# EAGLE design Relay Module v1.0 (EAGLE 7.2.0)
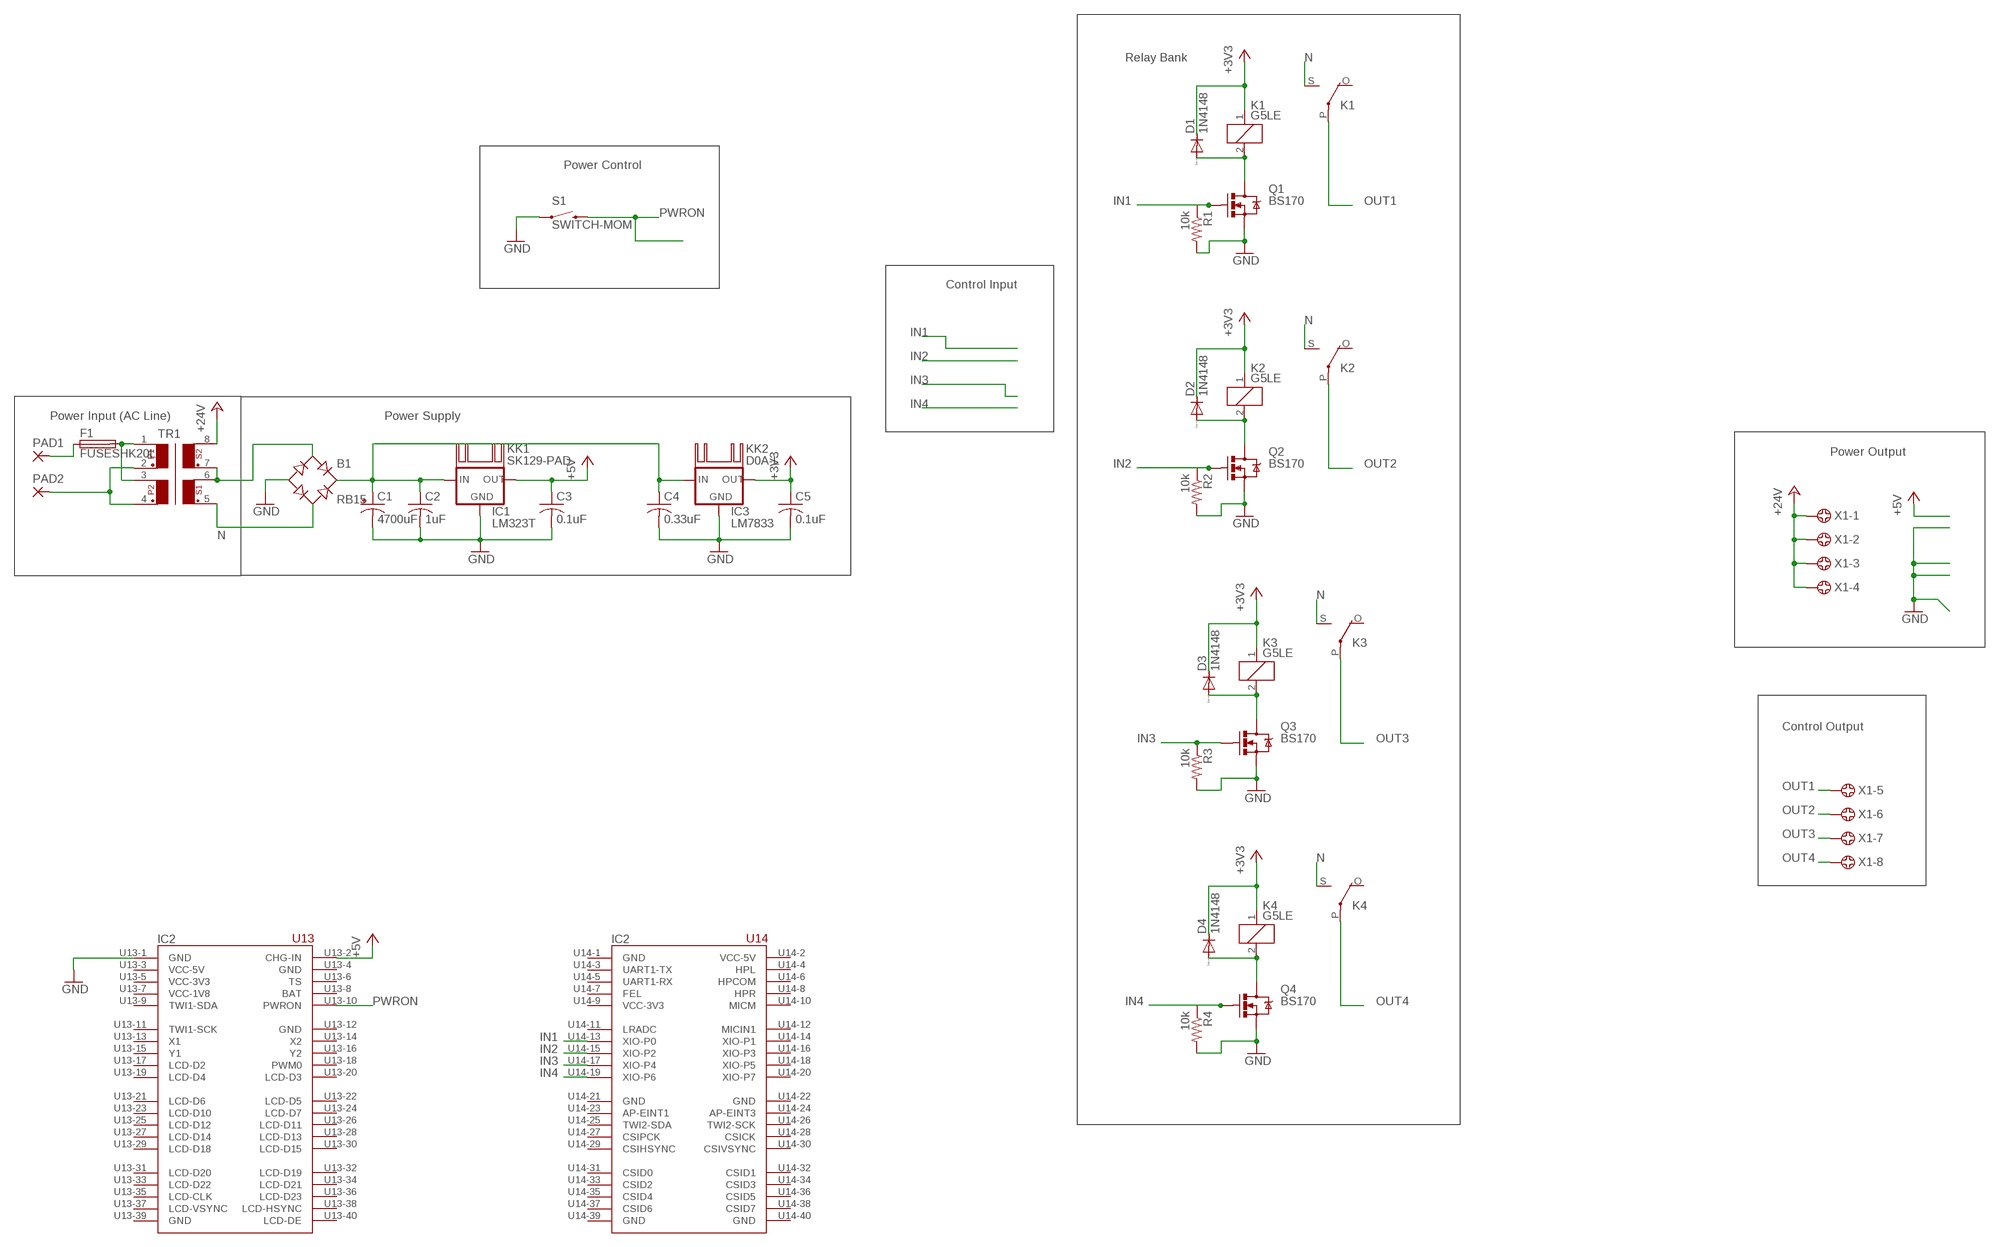
[diagram p0: schematic, sheet 1]

## Parts
B1  RB15  RECTIFIER-RB15  [RB15]
C1  4700uF  CPOL-USE7.5-18  [E7,5-18]
C2  1uF  C-US025-025X050  [C025-025X050]
C3  0.1uF  C-US025-025X050  [C025-025X050]
C4  0.33uF  C-US025-025X050  [C025-025X050]
C5  0.1uF  C-US025-025X050  [C025-025X050]
D1  1N4148  1N4148DO35-7  [DO35-7]
D2  1N4148  1N4148DO35-7  [DO35-7]
D3  1N4148  1N4148DO35-7  [DO35-7]
D4  1N4148  1N4148DO35-7  [DO35-7]
F1  FUSESHK20L  [SHK20L]
IC1  LM323T  LM323-TO3  [TO220S]
IC2  C_H_I_P-1_0  [C_H_I_P-1_0]
IC3  LM7833  78XXL  [78XXL]
K1  G5LE  [G5LE]
K2  G5LE  [G5LE]
K3  G5LE  [G5LE]
K4  G5LE  [G5LE]
KK1  SK129-PAD  [SK129]
KK2  D0A-L  [D02A-L]
PAD1  2,54/1,0  [2,54/1,0]
PAD2  2,54/1,0  [2,54/1,0]
Q1  BS170  MOSFET-NCHANNELBS170  [TO-92]
Q2  BS170  MOSFET-NCHANNELBS170  [TO-92]
Q3  BS170  MOSFET-NCHANNELBS170  [TO-92]
Q4  BS170  MOSFET-NCHANNELBS170  [TO-92]
R1  10k  R-US_0207/10  [0207/10]
R2  10k  R-US_0207/10  [0207/10]
R3  10k  R-US_0207/10  [0207/10]
R4  10k  R-US_0207/10  [0207/10]
S1  SWITCH-MOM  SWITCH-MOMENTARY-2PTH  [TACTILE-PTH]
TR1  FS24-1500-C2  [FS24-1500-C2]
X1  5202-08-N-02  [5202-08-N-02]

## Nets
+3V3 [power]: C5.1 D1.C D2.C D3.C D4.C IC3.OUT K1.1 K2.1 K3.1 K4.1
+5V [power]: C3.1 IC1.3(OUT) IC2.U13-2(CHG-IN)
+24V [power]: TR1.8 X1.1 X1.2 X1.3 X1.4
GND [power]: B1.- C1.- C2.2 C3.2 C4.2 C5.2 IC1.2(GND) IC2.U13-1(GND) IC3.GND Q1.3(S) Q2.3(S) Q3.3(S) Q4.3(S) R1.2 R2.2 R3.2 R4.2 S1.1
IN1: IC2.U14-13(XIO-P0) Q1.2(G) R1.1
IN2: IC2.U14-15(XIO-P2) Q2.2(G) R2.1
IN3: IC2.U14-17(XIO-P4) Q3.2(G) R3.1
IN4: IC2.U14-19(XIO-P6) Q4.2(G) R4.1
N [power]: B1.AC2 K1.S(2:S) K2.S(2:S) K3.S(2:S) K4.S(2:S) TR1.5
N$1 [power]: B1.+ C1.+ C2.1 C4.1 IC1.1(IN) IC3.IN
N$2 [power]: D1.A K1.2 Q1.1(D)
N$3: F1.2A TR1.1 TR1.3
N$4 [power]: D2.A K2.2 Q2.1(D)
N$6 [power]: D3.A K3.2 Q3.1(D)
N$7: F1.1A PAD1.1(P)
N$8 [power]: D4.A K4.2 Q4.1(D)
N$9 [power]: B1.AC1 TR1.6 TR1.7
N$10: PAD2.1(P) TR1.2 TR1.4
OUT1 [power]: K1.P(2:P) X1.5
OUT2 [power]: K2.P(2:P) X1.6
OUT3 [power]: K3.P(2:P) X1.7
OUT4 [power]: K4.P(2:P) X1.8
PWRON: IC2.U13-10(PWRON) S1.3
Unconnected: IC2.U13-3(VCC-5V) IC2.U13-5(VCC-3V3) IC2.U13-6(TS) IC2.U13-7(VCC-1V8) IC2.U13-9(TWI1-SDA) IC2.U13-11(TWI1-SCK) IC2.U13-13(X1) IC2.U13-14(X2) IC2.U13-15(Y1) IC2.U13-16(Y2) IC2.U13-17(LCD-D2) IC2.U13-18(PWM0) IC2.U13-19(LCD-D4) IC2.U13-20(LCD-D3) IC2.U13-21(LCD-D6) IC2.U13-22(LCD-D5) IC2.U13-23(LCD-D10) IC2.U13-24(LCD-D7) IC2.U13-25(LCD-D12) IC2.U13-26(LCD-D11) IC2.U13-27(LCD-D14) IC2.U13-28(LCD-D13) IC2.U13-29(LCD-D18) IC2.U13-30(LCD-D15) IC2.U13-31(LCD-D20) IC2.U13-32(LCD-D19) IC2.U13-33(LCD-D22) IC2.U13-34(LCD-D21) IC2.U13-35(LCD-CLK) IC2.U13-36(LCD-D23) IC2.U13-37(LCD-VSYNC) IC2.U13-38(LCD-HSYNC) IC2.U13-40(LCD-DE) IC2.U14-2(VCC-5V) IC2.U14-3(UART1-TX) IC2.U14-4(HPL) IC2.U14-5(UART1-RX) IC2.U14-6(HPCOM) IC2.U14-7(FEL) IC2.U14-8(HPR) IC2.U14-9(VCC-3V3) IC2.U14-10(MICM) IC2.U14-11(LRADC) IC2.U14-12(MICIN1) IC2.U14-14(XIO-P1) IC2.U14-16(XIO-P3) IC2.U14-18(XIO-P5) IC2.U14-20(XIO-P7) IC2.U14-23(AP-EINT1) IC2.U14-24(AP-EINT3) IC2.U14-25(TWI2-SDA) IC2.U14-26(TWI2-SCK) IC2.U14-27(CSIPCK) IC2.U14-28(CSICK) IC2.U14-29(CSIHSYNC) IC2.U14-30(CSIVSYNC) IC2.U14-31(CSID0) IC2.U14-32(CSID1) IC2.U14-33(CSID2) IC2.U14-34(CSID3) IC2.U14-35(CSID4) IC2.U14-36(CSID5) IC2.U14-37(CSID6) IC2.U14-38(CSID7) K1.O(2:O) K2.O(2:O) K3.O(2:O) K4.O(2:O) KK1.A2,5(K) KK1.B2,5(K)

## Notes on the sheet
- Relay Bank
- Power Control
- Control Input
- Power Input (AC Line) | Power Supply
- Power Output
- Control Output

## Power pins joined to a net without a drawn wire
BAT: IC2.U13-8(BAT)
GND: IC2.U13-4(GND) IC2.U13-12(GND) IC2.U13-39(GND) IC2.U14-1(GND) IC2.U14-21(GND) IC2.U14-22(GND) IC2.U14-39(GND) IC2.U14-40(GND)

## Library data of the parts
B1 = rectifier:RECTIFIER-: Rectifier
C1 = rcl:CPOL-US: POLARIZED CAPACITOR, American symbol
C2-C5 = rcl:C-US: CAPACITOR, American symbol
D1-D4 = diode:1N4148: DIODE high speed (Philips)
F1 = fuse:FUSE: Fuse; OC_FARNELL: unknown; OC_NEWARK: unknown
IC1 = v-reg:LM323-TO3: VOLTAGE REGULATOR
IC2 = SENG:C_H_I_P-1_0: C.H.I.P. 1.0 Linux computer module with on chip power management unit
IC3 = v-reg:78XXL: VOLTAGE REGULATOR
K1-K4 = relay:G5LE: RELAY 1 x switch, 10 A/120 V AC, 8 A/30 V DC, Omron; OC_FARNELL: unknown; OC_NEWARK: unknown
KK1 = heatsink:SK129-PAD: HEATSINK manufacturer Fischer/distributor Buerklin
KK2 = heatsink:D0A-L: HEATSINK distributor Schukat
PAD1 PAD2 = wirepad:2,54/1,0: THROUGH-HOLE PAD
Q1-Q4 = SparkFun-DiscreteSemi:MOSFET-NCHANNEL: Common NMOSFET Parts MFG P/N Store ID Prod ID FDD8780 TRANS-09984 SI7820DN TRANS-11055 FDS6630A IC-08089 2N7002PW TRANS-11151 FQP30N06L COM-10213 TRANS-10060 BSS123LT1G TRANS-08345 BSS138 TRANS-00830 BS170 2N7000
R1-R4 = rcl:R-US_: RESISTOR, American symbol
S1 = SparkFun-Electromechanical:SWITCH-MOMENTARY-2: Various NO switches- pushbuttons, reed, etc; PROD_ID: SWCH-08441
TR1 = trafo:FS24-1500-C2: TRANSFORMER 2 primary winding, 2 secondary windings, mounting holes ERA
X1 = con-ebyelectro:5202-08-N-02

## Net classes
0 default: width 0.508 mm, clearance 0.254 mm
1 power: width 1.27 mm, clearance 0.254 mm

## Board
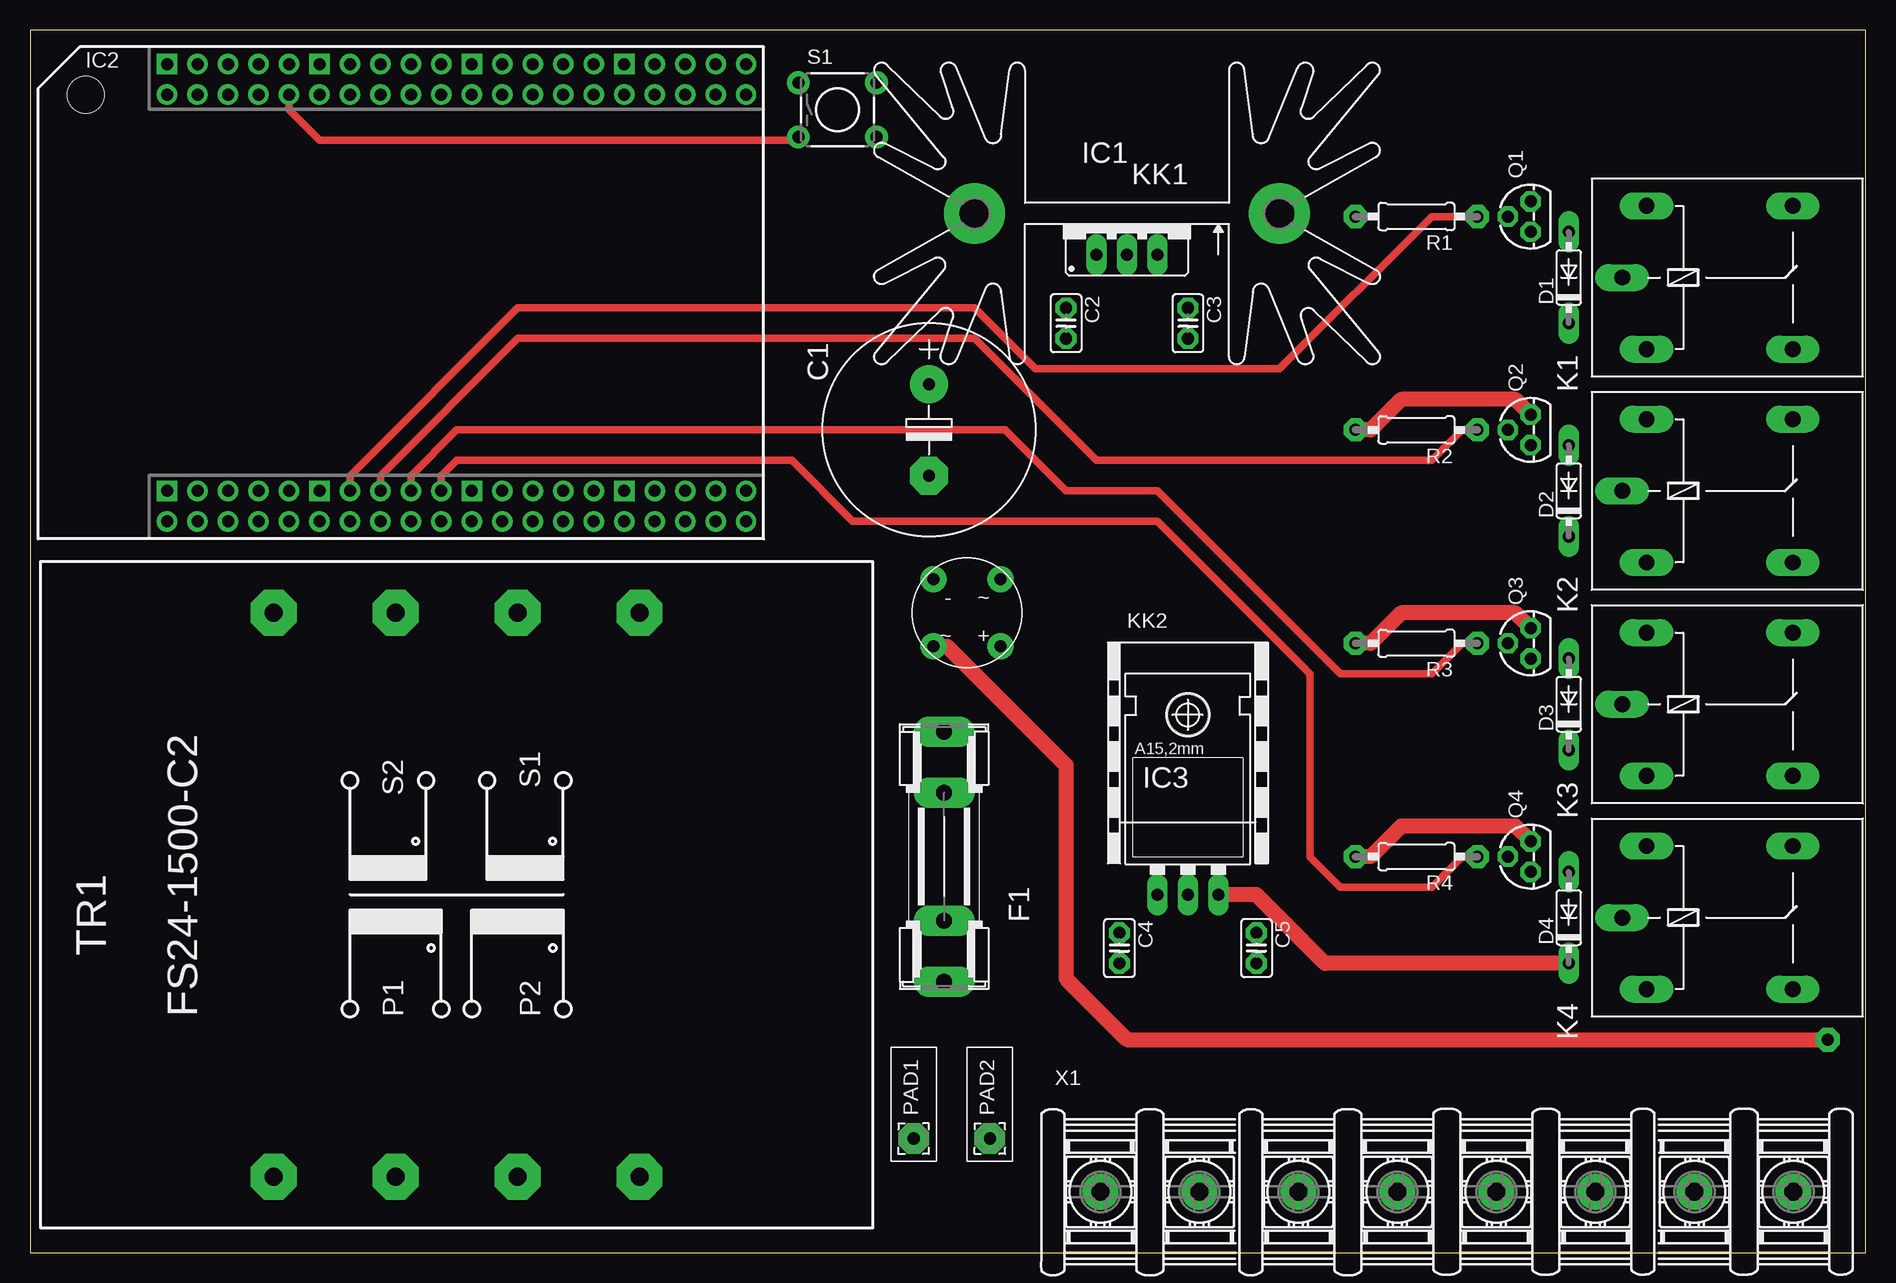
[diagram p1: board, top side]
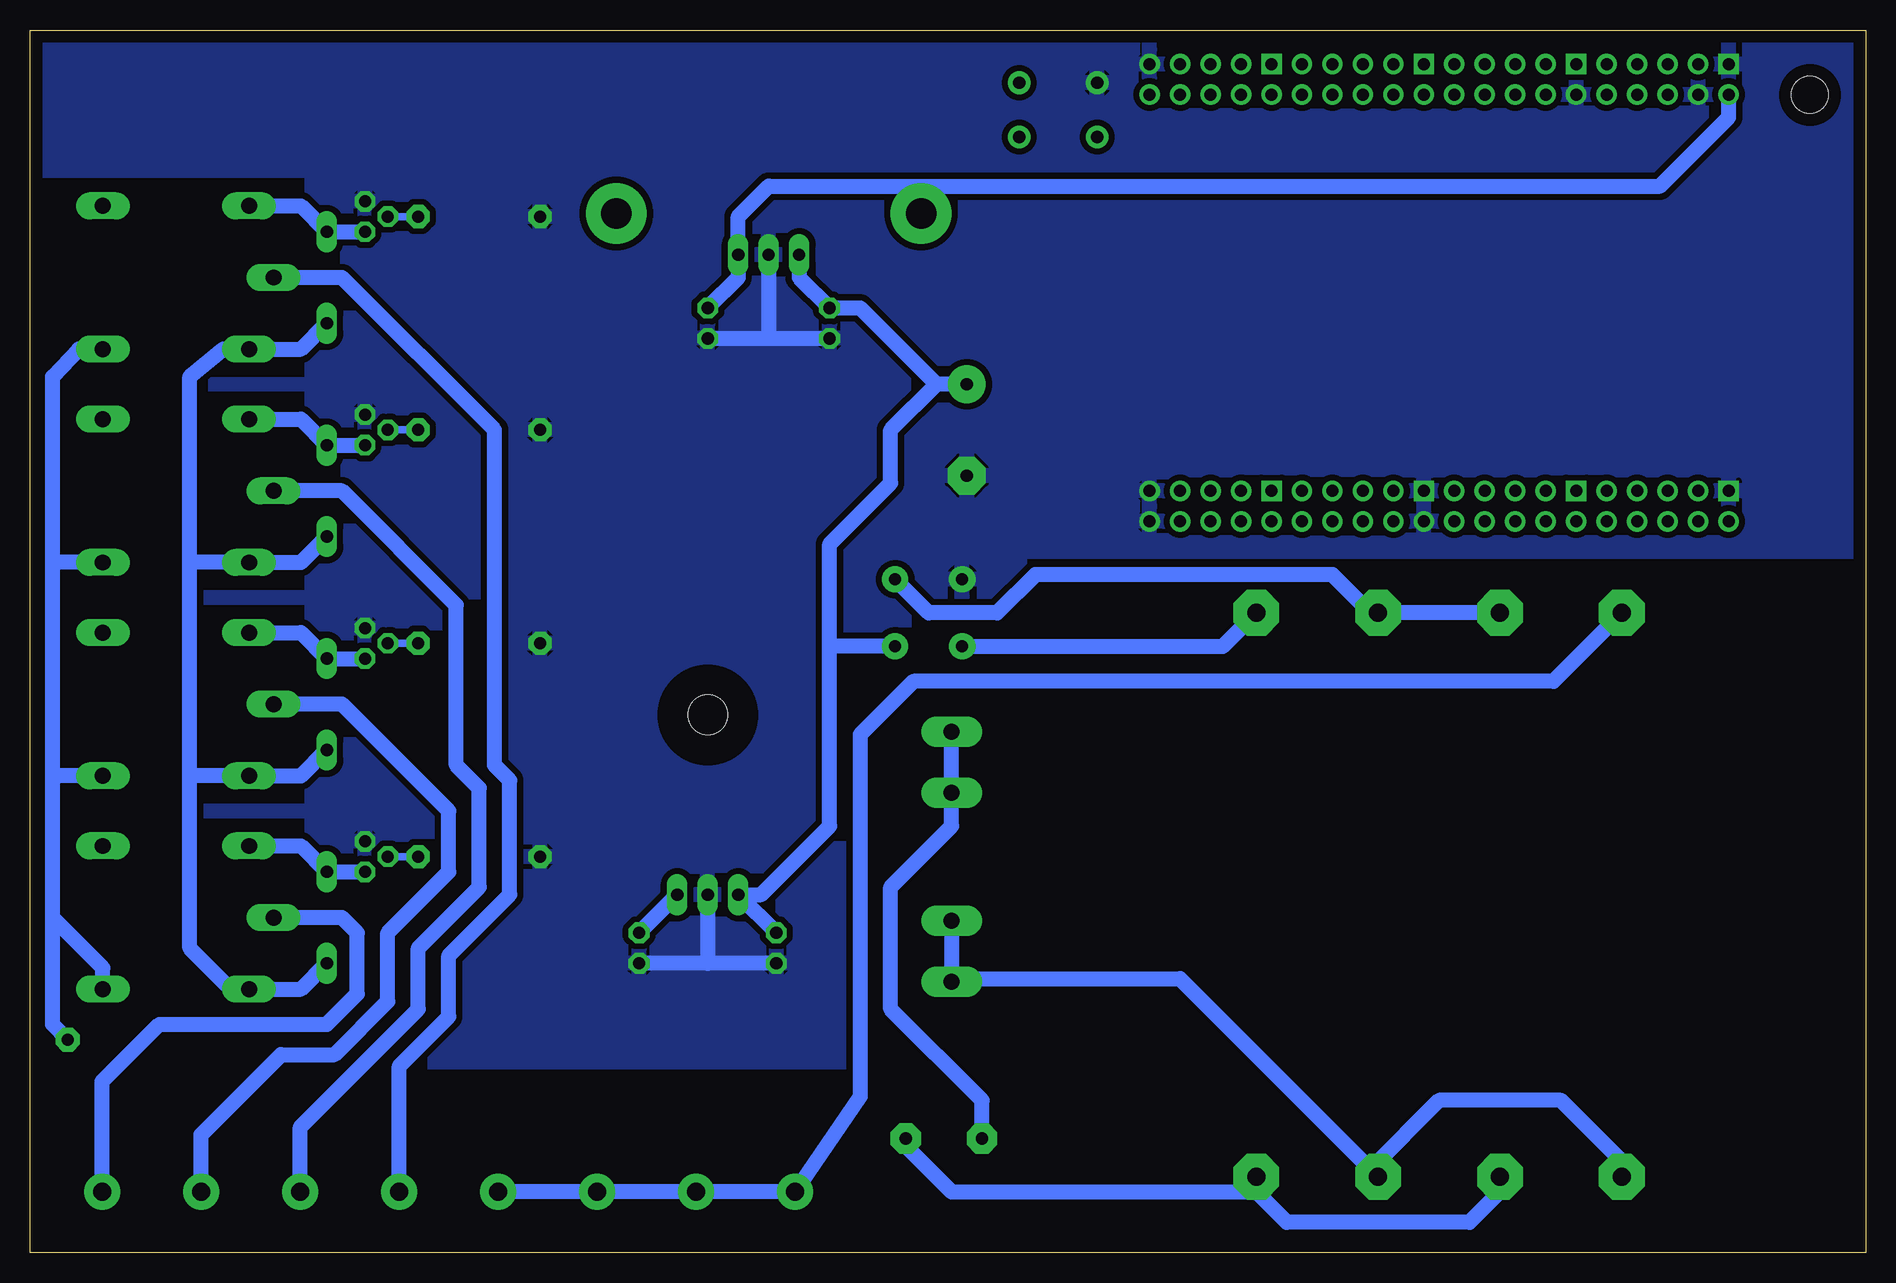
[diagram p2: board, bottom side, seen from below]

Size 153.01 x 101.91 mm. Coordinates in mm from the lower left corner, seen from the top.
Outline: 0,0 153.01,0 153.01,101.91 0,101.91 0,0
Copper layers (1*16): Top 0.035mm / dielectric 1.5mm / Bottom 0.035mm
Design rules "HomeFab": minimum track width 24mil, minimum drill 39mil, track to track 20mil, track to pad 20mil, pad to pad 20mil, via to via 20mil, smd to smd 8mil, copper to edge 40mil, drill to drill 8mil, minimum pad ring 10mil, minimum via ring 8mil, stop-mask expansion 4mil, vias tented up to drill 0mil, thermal gap 10mil
bRestrict: area 83.8,0 to 152.4,15.2

### Footprints (pad centres in the part's own frame; a part is rotated, then mirrored left to right if it is on the bottom)
RB15 = drill 1 pad 2.184: + -2.794,2.794; - 2.794,-2.794; AC1 -2.794,-2.794; AC2 2.794,2.794
E7,5-18 = drill 1.016 pad 3.15: + -3.81,0 | drill 1.016 pad 3.15 octagon: - 3.81,0
C025-025X050 = drill 1.016 pad 1.676 octagon: 1 -1.27,0; 2 1.27,0
DO35-7 = drill 1.016 long: A 3.81,0; C -3.81,0
SHK20L = drill 1.321 pad 2.54 long: 1A -10.414,0; 1B -5.334,0; 2A 10.414,0; 2B 5.334,0
TO220S = drill 1.016 long: 1 -2.54,-2.54; 2 0,-2.54; 3 2.54,-2.54
C_H_I_P-1_0 = drill 1 square: U13-1 0,0; U13-11 -12.7,0; U13-21 -25.4,0; U13-31 -38.1,0; U14-1 0,35.56; U14-11 -12.7,35.56; U14-21 -25.4,35.56; U14-31 -38.1,35.56 | drill 1: U13-2 0,2.54; U13-3 -2.54,0; U13-4 -2.54,2.54; U13-5 -5.08,0; U13-6 -5.08,2.54; U13-7 -7.62,0; U13-8 -7.62,2.54; U13-9 -10.16,0; U13-10 -10.16,2.54; U13-12 -12.7,2.54; U13-13 -15.24,0; U13-14 -15.24,2.54; U13-15 -17.78,0; U13-16 -17.78,2.54; U13-17 -20.32,0; U13-18 -20.32,2.54; U13-19 -22.86,0; U13-20 -22.86,2.54; U13-22 -25.4,2.54; U13-23 -27.94,0; U13-24 -27.94,2.54; U13-25 -30.48,0; U13-26 -30.48,2.54; U13-27 -33.02,0; U13-28 -33.02,2.54; U13-29 -35.56,0; U13-30 -35.56,2.54; U13-32 -38.1,2.54; U13-33 -40.64,0; U13-34 -40.64,2.54; U13-35 -43.18,0; U13-36 -43.18,2.54; U13-37 -45.72,0; U13-38 -45.72,2.54; U13-39 -48.26,0; U13-40 -48.26,2.54; U14-2 0,38.1; U14-3 -2.54,35.56; U14-4 -2.54,38.1; U14-5 -5.08,35.56; U14-6 -5.08,38.1; U14-7 -7.62,35.56; U14-8 -7.62,38.1; U14-9 -10.16,35.56; U14-10 -10.16,38.1; U14-12 -12.7,38.1; U14-13 -15.24,35.56; U14-14 -15.24,38.1; U14-15 -17.78,35.56; U14-16 -17.78,38.1; U14-17 -20.32,35.56; U14-18 -20.32,38.1; U14-19 -22.86,35.56; U14-20 -22.86,38.1; U14-22 -25.4,38.1; U14-23 -27.94,35.56; U14-24 -27.94,38.1; U14-25 -30.48,35.56; U14-26 -30.48,38.1; U14-27 -33.02,35.56; U14-28 -33.02,38.1; U14-29 -35.56,35.56; U14-30 -35.56,38.1; U14-32 -38.1,38.1; U14-33 -40.64,35.56; U14-34 -40.64,38.1; U14-35 -43.18,35.56; U14-36 -43.18,38.1; U14-37 -45.72,35.56; U14-38 -45.72,38.1; U14-39 -48.26,35.56; U14-40 -48.26,38.1 | hole 3.08: 6.78,2.56
78XXL = drill 1.016 long: GND 0,-3.81; IN -2.54,-3.81; OUT 2.54,-3.81 | hole 3.302: 0,11.176
G5LE = drill 1.321 long: 1 -7.493,-5.969; 2 -7.493,5.969; O 4.699,5.969; P -9.525,0; S 4.699,-5.969
SK129 = drill 2.54 pad 5.08: A2,5 -12.7,-0.889; B2,5 12.7,-0.889
2,54/1,0 = drill 1.016 pad 2.54 octagon: 1 0,0
TO-92 = drill 1 pad 1.676 octagon: 1 -1.27,0; 2 0,1.905; 3 1.27,0
0207/10 = drill 1 pad 1.93 octagon: 1 -5.08,0; 2 5.08,0
TACTILE-PTH = drill 1.016 pad 1.88: 1 -3.251,2.261; 2 3.251,2.261; 3 -3.251,-2.261; 4 3.251,-2.261
FS24-1500-C2 = drill 1.5 pad 3.81 octagon: 1 -23.495,15.24; 2 -23.495,5.08; 3 -23.495,-5.08; 4 -23.495,-15.24; 5 23.495,-15.24; 6 23.495,-5.08; 7 23.495,5.08; 8 23.495,15.24
5202-08-N-02 = drill 1.5 pad 3: 1 -28.885,0; 2 -20.635,0; 3 -12.375,0; 4 -4.125,0; 5 4.125,0; 6 12.375,0; 7 20.635,0; 8 28.885,0

### Placement (x,y rotation side)
B1  78.11,53.34 180 top
C1  74.93,68.58 270 top
C2  86.36,77.47 270 top
C3  96.52,77.47 270 top
C4  90.81,25.4 270 top
C5  102.23,25.4 270 top
D1  128.27,81.28 90 top
D2  128.27,63.5 90 top
D3  128.27,45.72 90 top
D4  128.27,27.94 90 top
F1  76.2,33.02 270 top
IC1  91.44,85.72 0 top
IC2  11.43,99.06 180 top
IC3  96.52,33.66 0 top
K1  142.24,81.28 0 top
K2  142.24,63.5 0 top
K3  142.24,45.72 0 top
K4  142.24,27.94 0 top
KK1  91.44,85.72 180 top
KK2  96.52,39.37 270 top
PAD1  73.66,9.53 90 top
PAD2  80.01,9.53 90 top
Q1  125.09,86.36 90 top
Q2  125.09,68.58 90 top
Q3  125.09,50.8 90 top
Q4  125.09,33.02 90 top
R1  115.57,86.36 180 top
R2  115.57,68.58 180 top
R3  115.57,50.8 180 top
R4  115.57,33.02 180 top
S1  67.31,95.25 0 top
TR1  35.56,29.84 90 top
X1  118.11,5.08 0 top

### Tracks (layer width: path | path; a pad name or v marks a point on that pad's centre or on a via)
+3V3
  Top 1.27: D4.C 107.95,24.13 102.23,29.84 IC3.OUT
  Bottom 1.27: 139.7,40.01 139.7,25.4 136.27,21.97 K4.1 130.43,21.97 D4.C | 139.7,40.01 139.7,57.78 | 139.7,57.78 139.7,73.03 136.91,75.31 K1.1 130.43,75.31 D1.C | 139.7,57.78 139.45,57.53 K2.1 130.43,57.53 D2.C | 139.7,40.01 139.45,39.75 K3.1 130.43,39.75 D3.C | IC3.OUT C5.1
+5V
  Bottom 1.27: C3.1 93.98,81.28 IC1.3 93.98,86.36 91.44,88.9 17.14,88.9 11.43,94.61 IC2.U13-2
+24V
  Bottom 1.27: TR1.8 26.04,47.62 79.38,47.62 83.82,43.18 83.82,13.03 X1.1 X1.2 X1.3 X1.4
GND
  Top 1.27: Q2.3 123.83,71.12 114.3,71.12 111.76,68.58 R2.2 | Q3.3 123.83,53.34 114.3,53.34 111.76,50.8 R3.2 | Q4.3 123.83,35.56 114.3,35.56 111.76,33.02 R4.2
  Bottom 1.27: C4.2 96.52,24.13 | 96.52,24.13 C5.2 | IC3.GND 96.52,24.13 | C3.2 91.44,76.2 | 91.44,76.2 C2.2 | IC1.2 91.44,76.2
  pour Bottom: 0,0 152.4,0 152.4,101.6 0,101.6
IN1
  Top 0.61: R1.1 116.84,86.36 104.14,73.66 83.82,73.66 78.74,78.74 40.64,78.74 26.67,64.77 IC2.U14-13
  Bottom 0.61: Q1.2 R1.1
IN2
  Top 0.61: R2.1 119.38,68.58 116.84,66.04 88.9,66.04 78.74,76.2 40.64,76.2 29.21,64.77 IC2.U14-15
  Bottom 0.61: Q2.2 R2.1
IN3
  Top 0.61: R3.1 119.38,50.8 116.84,48.26 109.22,48.26 93.98,63.5 86.36,63.5 81.28,68.58 35.56,68.58 31.75,64.77 IC2.U14-17
  Bottom 0.61: Q3.2 R3.1
IN4
  Top 0.61: R4.1 119.38,33.02 116.84,30.48 109.22,30.48 106.68,33.02 106.68,48.26 93.98,60.96 68.58,60.96 63.5,66.04 35.56,66.04 34.29,64.77 IC2.U14-19
  Bottom 0.61: Q4.2 R4.1
N  (via drill 1 pad 1.68)
  Top 1.27: B1.AC2 76.45,50.55 86.36,40.64 86.36,22.86 91.44,17.78 v149.86,17.78
  Bottom 1.27: K4.S 146.94,23.75 151.13,27.94 | 151.13,27.94 151.13,39.37 | 151.13,39.37 151.13,57.15 | 151.13,57.15 151.13,73.03 148.97,75.31 K1.S | K2.S 150.75,57.53 151.13,57.15 | K3.S 150.75,39.75 151.13,39.37 | B1.AC2 53.59,50.55 TR1.5 | v149.86,17.78 151.13,19.05 151.13,27.94
N$1
  Bottom 1.27: IC1.1 88.9,81.28 C2.1 83.82,78.74 77.47,72.39 | C4.1 IC3.IN 92.08,29.84 86.36,35.56 86.36,50.8 | C1.+ 77.47,72.39 | 77.47,72.39 81.28,68.58 81.28,64.14 86.36,59.05 86.36,50.8 | B1.+ 86.11,50.55 86.36,50.8
N$2
  Bottom 1.27: K1.2 130.43,87.25 D1.A Q1.1
N$3
  Bottom 1.27: F1.2A 76.2,22.86 | 76.2,27.94 76.2,22.86 | 76.2,22.86 57.15,22.86 41.27,6.99 | 41.27,6.99 TR1.3 | TR1.1 20.32,7.62 25.4,12.7 35.56,12.7 41.27,6.99
N$4
  Bottom 1.27: K2.2 130.43,69.47 D2.A Q2.1
N$6
  Bottom 1.27: K3.2 130.43,51.69 D3.A Q3.1
N$7
  Bottom 1.27: PAD1.1 73.66,12.7 81.28,20.32 81.28,30.48 76.2,35.56 F1.1A
N$8
  Bottom 1.27: K4.2 130.43,33.91 D4.A Q4.1
N$9
  Bottom 1.27: TR1.7 TR1.6 41.27,53.34 44.45,56.52 69.22,56.52 72.39,53.34 78.11,53.34 B1.AC1
N$10
  Bottom 1.27: TR1.2 30.48,5.08 33.02,2.54 48.26,2.54 50.8,5.08 | 50.8,5.08 TR1.4 | PAD2.1 80.01,8.89 76.2,5.08 50.8,5.08
OUT1
  Bottom 1.27: X1.5 122.23,15.56 118.11,19.68 118.11,24.77 113.03,29.84 113.03,39.37 114.3,40.64 114.3,68.58 127,81.28 K1.P
OUT2
  Bottom 1.27: X1.6 130.49,10.48 120.65,20.32 120.65,25.4 115.57,30.48 115.57,38.73 117.47,40.64 117.47,53.98 127,63.5 K2.P
OUT3
  Bottom 1.27: X1.7 138.75,9.85 132.08,16.51 127.64,16.51 123.19,20.95 123.19,26.67 118.11,31.75 118.11,36.83 127,45.72 K3.P
OUT4
  Bottom 1.27: X1.8 147,14.29 142.24,19.05 128.27,19.05 125.73,21.59 125.73,26.67 127,27.94 K4.P
PWRON
  Top 0.61: S1.3 63.78,92.71 24.13,92.71 21.59,95.25 IC2.U13-10